# Altium schematic sheet WallLightRemote_V1.0.SchDoc: WallLight Remote
size A4; PageSetup: Record=PageOptions|CenterHorizontal=True|CenterVertical=True|PrintScale=0.97|XCorrection=1.00|YCorrection=1.00|PrintKind=0|BorderSize=5000000|LeftOffset=0|BottomOffset=0|Orientation=2|PaperLength=1000|PaperWidth=1000|Scale=100|PaperSource=7|PrintQuality=-3|MediaType=1|DitherType=10|PrintScaleMode=1|PaperKind=A4|PaperIndex=9; Organization: Crelin; Address1: Karl-Neuhaus-Strasse 6, 2502 Biel; Address2: Florian Baumgartner; Address3: florian.b-h@bluewin.ch; Address4: Tel: (+41) 32-323 56 25 / (+41) 79-502 92 10; DocumentNumber: Overview; Revision: V1.0; SheetNumber: 1; SheetTotal: 5; Author: Florian Baumgartner
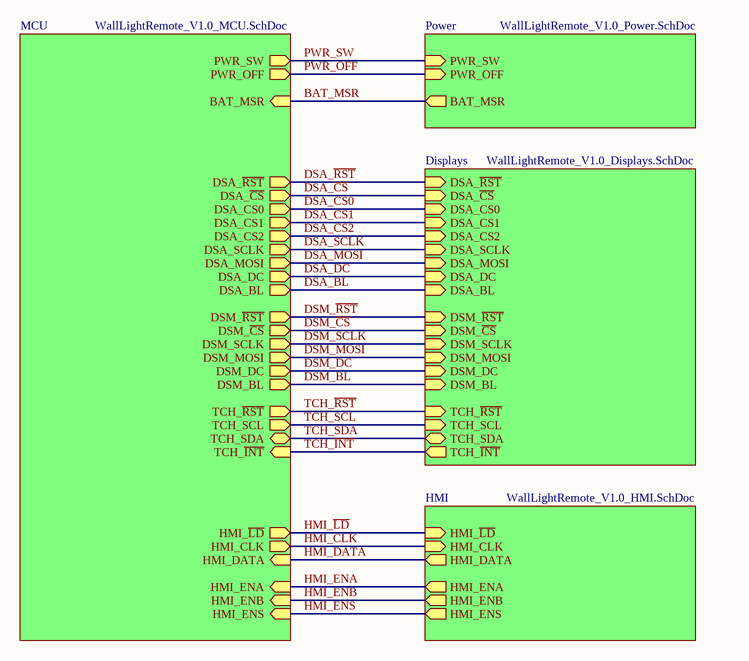
[diagram p0: WallLightRemote_V1.0.SchDoc]

## Sub-sheets
Displays = WallLightRemote_V1.0_Displays.SchDoc: DSA_~{RST} (in), DSA_CS2 (in), TCH_~{RST} (in), DSA_MOSI (in), DSA_CS1 (in), DSA_DC (in), DSA_~{CS} (in), DSM_DC (in), DSA_SCLK (in), DSM_BL (in), DSM_~{RST} (in), TCH_SCL (in), DSA_CS0 (in), TCH_SDA (bidir), TCH_~{INT} (out), DSM_SCLK (in), DSA_BL (in), DSM_MOSI (in), DSM_~{CS} (in)
HMI = WallLightRemote_V1.0_HMI.SchDoc: HMI_~{LD} (in), HMI_DATA (out), HMI_ENB (out), HMI_ENA (out), HMI_ENS (out), HMI_CLK (in)
MCU = WallLightRemote_V1.0_MCU.SchDoc: DSA_~{RST} (out), DSM_SCLK (out), HMI_ENA (in), TCH_~{INT} (in), DSM_~{RST} (out), DSA_SCLK (out), TCH_SDA (bidir), HMI_~{LD} (out), DSA_CS2 (out), DSM_MOSI (out), TCH_~{RST} (out), PWR_OFF (out), DSA_MOSI (out), DSA_DC (out), DSA_CS0 (out), DSA_CS1 (out), DSM_DC (out), BAT_MSR (in), PWR_SW (out), DSM_~{CS} (out), DSM_BL (out), HMI_ENS (in), HMI_DATA (in), DSA_~{CS} (out), HMI_CLK (out), DSA_BL (out), HMI_ENB (in), TCH_SCL (out)
Power = WallLightRemote_V1.0_Power.SchDoc: PWR_SW (in), PWR_OFF (in), BAT_MSR (out)

## Nets
BAT_MSR: sheet MCU/BAT_MSR, sheet Power/BAT_MSR
DSA_BL: sheet MCU/DSA_BL, sheet Displays/DSA_BL
DSA_~{CS}: sheet MCU/DSA_~{CS}, sheet Displays/DSA_~{CS}
DSA_CS0: sheet MCU/DSA_CS0, sheet Displays/DSA_CS0
DSA_CS1: sheet MCU/DSA_CS1, sheet Displays/DSA_CS1
DSA_CS2: sheet MCU/DSA_CS2, sheet Displays/DSA_CS2
DSA_DC: sheet MCU/DSA_DC, sheet Displays/DSA_DC
DSA_MOSI: sheet MCU/DSA_MOSI, sheet Displays/DSA_MOSI
DSA_~{RST}: sheet MCU/DSA_~{RST}, sheet Displays/DSA_~{RST}
DSA_SCLK: sheet MCU/DSA_SCLK, sheet Displays/DSA_SCLK
DSM_BL: sheet MCU/DSM_BL, sheet Displays/DSM_BL
DSM_~{CS}: sheet MCU/DSM_~{CS}, sheet Displays/DSM_~{CS}
DSM_DC: sheet MCU/DSM_DC, sheet Displays/DSM_DC
DSM_MOSI: sheet MCU/DSM_MOSI, sheet Displays/DSM_MOSI
DSM_~{RST}: sheet MCU/DSM_~{RST}, sheet Displays/DSM_~{RST}
DSM_SCLK: sheet MCU/DSM_SCLK, sheet Displays/DSM_SCLK
HMI_CLK: sheet MCU/HMI_CLK, sheet HMI/HMI_CLK
HMI_DATA: sheet MCU/HMI_DATA, sheet HMI/HMI_DATA
HMI_ENA: sheet MCU/HMI_ENA, sheet HMI/HMI_ENA
HMI_ENB: sheet MCU/HMI_ENB, sheet HMI/HMI_ENB
HMI_ENS: sheet MCU/HMI_ENS, sheet HMI/HMI_ENS
HMI_~{LD}: sheet MCU/HMI_~{LD}, sheet HMI/HMI_~{LD}
PWR_OFF: sheet MCU/PWR_OFF, sheet Power/PWR_OFF
PWR_SW: sheet MCU/PWR_SW, sheet Power/PWR_SW
TCH_~{INT}: sheet MCU/TCH_~{INT}, sheet Displays/TCH_~{INT}
TCH_~{RST}: sheet MCU/TCH_~{RST}, sheet Displays/TCH_~{RST}
TCH_SCL: sheet MCU/TCH_SCL, sheet Displays/TCH_SCL
TCH_SDA: sheet MCU/TCH_SDA, sheet Displays/TCH_SDA

## Notes on the sheet
- Title
- Crelin
- Author:
- Subtitle
- Date:
- Rev:
- File:
- Sheet
- of